# Altium schematic sheet Modulator.schdoc: Modulator v1.0
size 420 x 297 mm; Author: shanasz; CompanyName: WUT; DrawnBy: shanasz; Organization: WUT ISE; Address1: Warsaw Univeristy of Technology; Address2: Nowowiejska 15/19; DocumentNumber: 1; Revision: -; SheetNumber: 1; SheetTotal: 6; EDA_Number: ARTIQ; Projet: ARTIQ/SINARA; ModifiedBy: -; CreateDate: XX/XX/XXXX; CheckedDate: -; Title2: Top entity; DivGrp: ISE; Designer: shanasz; ModifiedDate: -; ProjectName: ARTIQ/SINARA
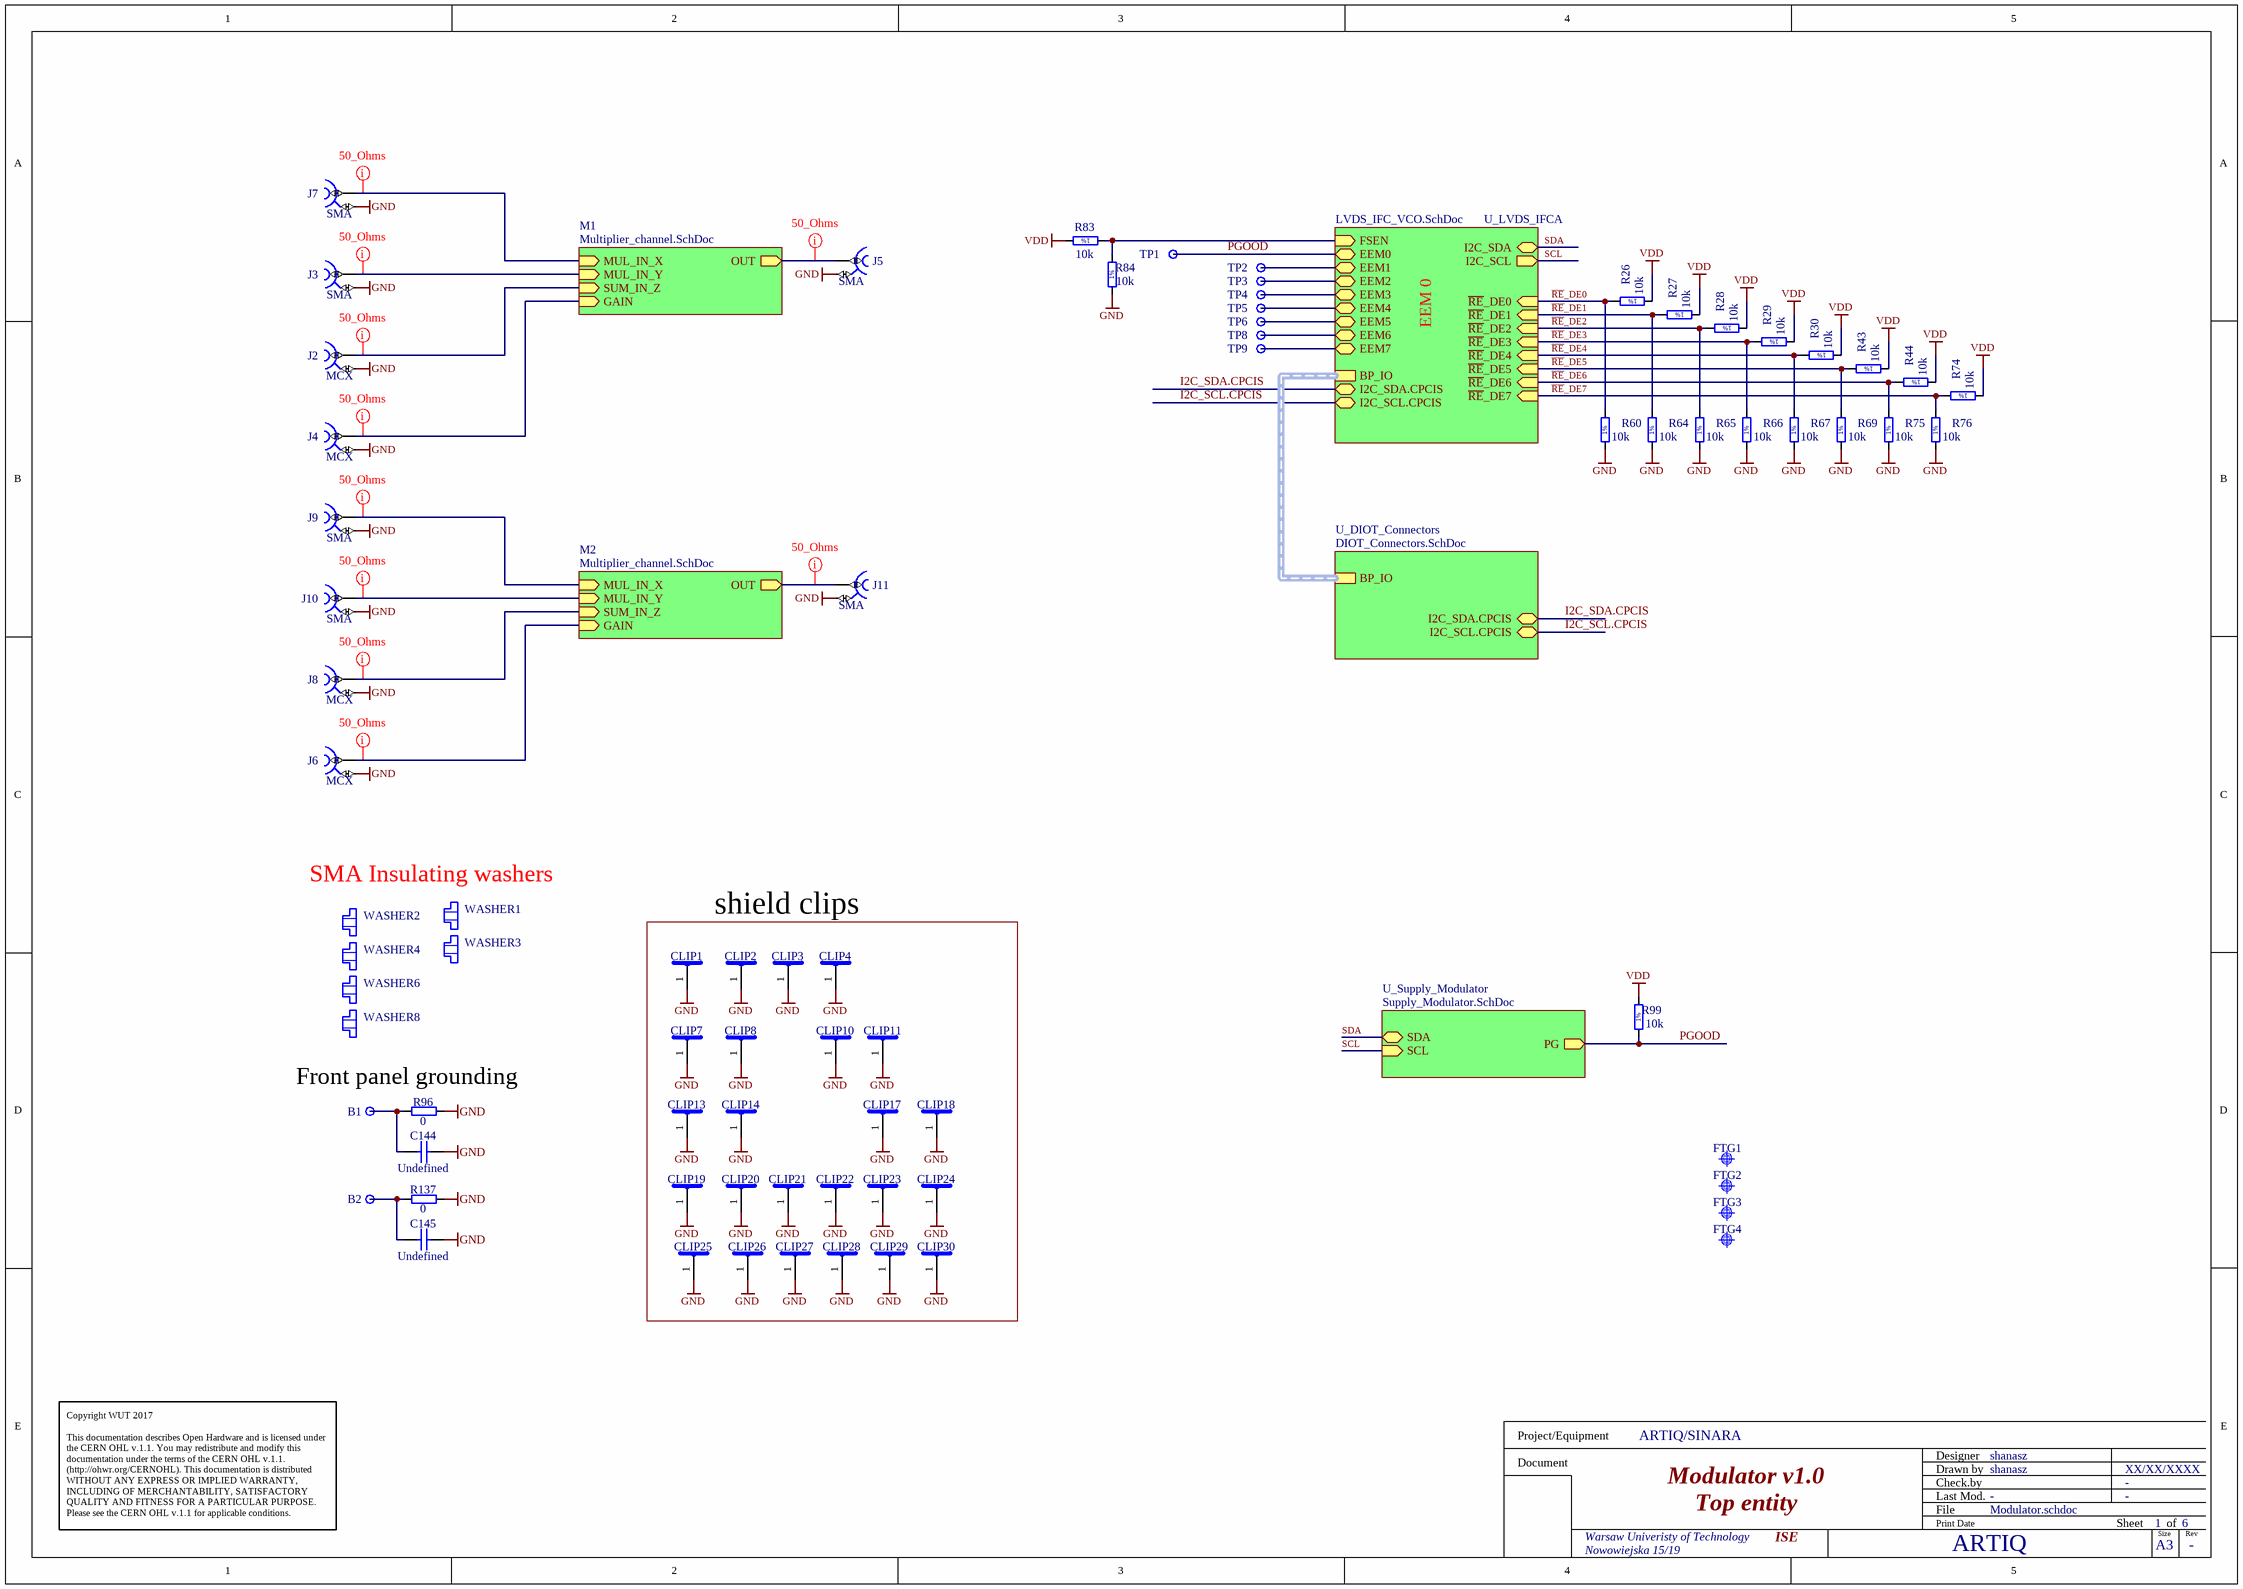
[diagram p0: Modulator.schdoc]

## Parts
B1  Plated Hole  [MTG270_500]  (value not drawn)  (no BOM)
B2  Plated Hole  [MTG270_500]  (value not drawn)  (no BOM)
C144  Undefined  [CAPC2012X135N]
C145  Undefined  [CAPC2012X135N]
CLIP1  S1411-46R  [CLIP_HOLLAND-SHIELDING_LC]  (value not drawn)
CLIP2  S1411-46R  [CLIP_HOLLAND-SHIELDING_LC]  (value not drawn)
CLIP3  S1411-46R  [CLIP_HOLLAND-SHIELDING_LC]  (value not drawn)
CLIP4  S1411-46R  [CLIP_HOLLAND-SHIELDING_LC]  (value not drawn)
CLIP7  S1411-46R  [CLIP_HOLLAND-SHIELDING_LC]  (value not drawn)
CLIP8  S1411-46R  [CLIP_HOLLAND-SHIELDING_LC]  (value not drawn)
CLIP10  S1411-46R  [CLIP_HOLLAND-SHIELDING_LC]  (value not drawn)
CLIP11  S1411-46R  [CLIP_HOLLAND-SHIELDING_LC]  (value not drawn)
CLIP13  S1411-46R  [CLIP_HOLLAND-SHIELDING_LC]  (value not drawn)
CLIP14  S1411-46R  [CLIP_HOLLAND-SHIELDING_LC]  (value not drawn)
CLIP17  S1411-46R  [CLIP_HOLLAND-SHIELDING_LC]  (value not drawn)
CLIP18  S1411-46R  [CLIP_HOLLAND-SHIELDING_LC]  (value not drawn)
CLIP19  S1411-46R  [CLIP_HOLLAND-SHIELDING_LC]  (value not drawn)
CLIP20  S1411-46R  [CLIP_HOLLAND-SHIELDING_LC]  (value not drawn)
CLIP21  S1411-46R  [CLIP_HOLLAND-SHIELDING_LC]  (value not drawn)
CLIP22  S1411-46R  [CLIP_HOLLAND-SHIELDING_LC]  (value not drawn)
CLIP23  S1411-46R  [CLIP_HOLLAND-SHIELDING_LC]  (value not drawn)
CLIP24  S1411-46R  [CLIP_HOLLAND-SHIELDING_LC]  (value not drawn)
CLIP25  S1411-46R  [CLIP_HOLLAND-SHIELDING_LC]  (value not drawn)
CLIP26  S1411-46R  [CLIP_HOLLAND-SHIELDING_LC]  (value not drawn)
CLIP27  S1411-46R  [CLIP_HOLLAND-SHIELDING_LC]  (value not drawn)
CLIP28  S1411-46R  [CLIP_HOLLAND-SHIELDING_LC]  (value not drawn)
CLIP29  S1411-46R  [CLIP_HOLLAND-SHIELDING_LC]  (value not drawn)
CLIP30  S1411-46R  [CLIP_HOLLAND-SHIELDING_LC]  (value not drawn)
FTG1  Use only in PCB  [FIDUCIAL_TOP_C100-200]  (value not drawn)  (no BOM)
FTG2  Use only in PCB  [FIDUCIAL_TOP_S100-200]  (value not drawn)  (no BOM)
FTG3  Use only in PCB  [FIDUCIAL_TOP_S200-400]  (value not drawn)  (no BOM)
FTG4  Use only in PCB  [FIDUCIAL_TOP_S100-200]  (value not drawn)  (no BOM)
J2  MCX  [AMPHENOL_919-383J-51A]
J3  SMA  [DELOCK_65848]
J4  MCX  [AMPHENOL_919-383J-51A]
J5  SMA  [DELOCK_65848]
J6  MCX  [AMPHENOL_919-383J-51A]
J7  SMA  [DELOCK_65848]
J8  MCX  [AMPHENOL_919-383J-51A]
J9  SMA  [DELOCK_65848]
J10  SMA  [DELOCK_65848]
J11  SMA  [DELOCK_65848]
R26  10k  [RESC1005X40N]
R27  10k  [RESC1005X40N]
R28  10k  [RESC1005X40N]
R29  10k  [RESC1005X40N]
R30  10k  [RESC1005X40N]
R43  10k  [RESC1005X40N]
R44  10k  [RESC1005X40N]
R60  10k  [RESC1005X40N]
R64  10k  [RESC1005X40N]
R65  10k  [RESC1005X40N]
R66  10k  [RESC1005X40N]
R67  10k  [RESC1005X40N]
R69  10k  [RESC1005X40N]
R74  10k  [RESC1005X40N]
R75  10k  [RESC1005X40N]
R76  10k  [RESC1005X40N]
R83  10k  [RESC1005X40N]
R84  10k  [RESC1005X40N]
R96  0  [RESC1608X55N]
R99  10k  [RESC1005X40N]
R137  0  [RESC1608X55N]
TP1  Test Point  [TPS127]  (value not drawn)  (no BOM)
TP2  Test Point  [TPS127]  (value not drawn)  (no BOM)
TP3  Test Point  [TPS127]  (value not drawn)  (no BOM)
TP4  Test Point  [TPS127]  (value not drawn)  (no BOM)
TP5  Test Point  [TPS127]  (value not drawn)  (no BOM)
TP6  Test Point  [TPS127]  (value not drawn)  (no BOM)
TP8  Test Point  [TPS127]  (value not drawn)  (no BOM)
TP9  Test Point  [TPS127]  (value not drawn)  (no BOM)
WASHER1  (no value)  [Keystone_7687]
WASHER2  (no value)  [Keystone_7687]
WASHER3  (no value)  [Keystone_7687]
WASHER4  (no value)  [Keystone_7687]
WASHER6  (no value)  [Keystone_7687]
WASHER8  (no value)  [Keystone_7687]

## Blocks framed on the sheet
shield clips: CLIP1-CLIP4 CLIP7 CLIP8 CLIP10 CLIP11 CLIP13 CLIP14 CLIP17-CLIP30

## Sub-sheets
M1 = Multiplier_channel.SchDoc: MUL_IN_X (in), MUL_IN_Y (in), SUM_IN_Z (in), OUT (out), GAIN (in)
M2 = Multiplier_channel.SchDoc: MUL_IN_X (in), MUL_IN_Y (in), SUM_IN_Z (in), OUT (out), GAIN (in)
U_DIOT_Connectors = DIOT_Connectors.SchDoc: BP_IO (harness BP_Conn), I2C_SDA.CPCIS (bidir), I2C_SCL.CPCIS (bidir)
U_LVDS_IFCA = LVDS_IFC_VCO.SchDoc: ~{RE}_DE1 (in), ~{RE}_DE2 (in), ~{RE}_DE3 (in), ~{RE}_DE4 (in), ~{RE}_DE5 (in), ~{RE}_DE6 (in), ~{RE}_DE7 (in), ~{RE}_DE0 (in), I2C_SDA (bidir), I2C_SCL (out), EEM1 (bidir), EEM2 (bidir), EEM5 (bidir), EEM6 (bidir), EEM7 (bidir), EEM3 (bidir), EEM4 (bidir), EEM0 (bidir), FSEN (in), BP_IO (harness BP_Conn), I2C_SDA.CPCIS (bidir), I2C_SCL.CPCIS (bidir)
U_Supply_Modulator = Supply_Modulator.SchDoc: SDA (bidir), SCL (in), PG (out)

## Nets
GND: C144.2 C145.2 CLIP1.1 CLIP2.1 CLIP3.1 CLIP4.1 CLIP7.1 CLIP8.1 CLIP10.1 CLIP11.1 CLIP13.1 CLIP14.1 CLIP17.1 CLIP18.1 CLIP19.1 CLIP20.1 CLIP21.1 CLIP22.1 CLIP23.1 CLIP24.1 CLIP25.1 CLIP26.1 CLIP27.1 CLIP28.1 CLIP29.1 CLIP30.1 J2.2 J3.2 J4.2 J5.2 J6.2 J7.2 J8.2 J9.2 J10.2 J11.2 R60.1 R64.1 R65.1 R66.1 R67.1 R69.1 R75.1 R76.1 R84.1 R96.2 R137.2
VDD: R26.1 R27.1 R28.1 R29.1 R30.1 R43.1 R44.1 R74.1 R83.1 R99.2
I2C_SCL.CPCIS: sheet U_LVDS_IFCA/I2C_SCL.CPCIS, sheet U_DIOT_Connectors/I2C_SCL.CPCIS
I2C_SDA.CPCIS: sheet U_LVDS_IFCA/I2C_SDA.CPCIS, sheet U_DIOT_Connectors/I2C_SDA.CPCIS
PGOOD: R99.1 TP1.1 ; sheet U_LVDS_IFCA/EEM0, sheet U_Supply_Modulator/PG
~{RE}_DE0: R26.2 R60.2 ; sheet U_LVDS_IFCA/~{RE}_DE0
~{RE}_DE1: R27.2 R64.2 ; sheet U_LVDS_IFCA/~{RE}_DE1
~{RE}_DE2: R28.2 R65.2 ; sheet U_LVDS_IFCA/~{RE}_DE2
~{RE}_DE3: R29.2 R66.2 ; sheet U_LVDS_IFCA/~{RE}_DE3
~{RE}_DE4: R30.2 R67.2 ; sheet U_LVDS_IFCA/~{RE}_DE4
~{RE}_DE5: R43.2 R69.2 ; sheet U_LVDS_IFCA/~{RE}_DE5
~{RE}_DE6: R44.2 R75.2 ; sheet U_LVDS_IFCA/~{RE}_DE6
~{RE}_DE7: R74.2 R76.2 ; sheet U_LVDS_IFCA/~{RE}_DE7
SCL: sheet U_LVDS_IFCA/I2C_SCL, sheet U_Supply_Modulator/SCL
SDA: sheet U_LVDS_IFCA/I2C_SDA, sheet U_Supply_Modulator/SDA
NetB1_1: B1.1 C144.1 R96.1
NetB2_1: B2.1 C145.1 R137.1
NetJ2_1: J2.1 ; sheet M1/SUM_IN_Z
NetJ3_1: J3.1 ; sheet M1/MUL_IN_Y
NetJ4_1: J4.1 ; sheet M1/GAIN
NetJ5_1: J5.1 ; sheet M1/OUT
NetJ6_1: J6.1 ; sheet M2/GAIN
NetJ7_1: J7.1 ; sheet M1/MUL_IN_X
NetJ8_1: J8.1 ; sheet M2/SUM_IN_Z
NetJ9_1: J9.1 ; sheet M2/MUL_IN_X
NetJ10_1: J10.1 ; sheet M2/MUL_IN_Y
NetJ11_1: J11.1 ; sheet M2/OUT
NetR83_2: R83.2 R84.2 ; sheet U_LVDS_IFCA/FSEN
NetTP2_1: TP2.1 ; sheet U_LVDS_IFCA/EEM1
NetTP3_1: TP3.1 ; sheet U_LVDS_IFCA/EEM2
NetTP4_1: TP4.1 ; sheet U_LVDS_IFCA/EEM3
NetTP5_1: TP5.1 ; sheet U_LVDS_IFCA/EEM4
NetTP6_1: TP6.1 ; sheet U_LVDS_IFCA/EEM5
NetTP8_1: TP8.1 ; sheet U_LVDS_IFCA/EEM6
NetTP9_1: TP9.1 ; sheet U_LVDS_IFCA/EEM7

## Buses and harness runs
harness sheet U_DIOT_Connectors/BP_IO = sheet U_LVDS_IFCA/BP_IO

## Layout directives
net class 50_Ohms: NetJ2_1, NetJ3_1, NetJ4_1, NetJ5_1, NetJ6_1, NetJ7_1, NetJ8_1, NetJ9_1, NetJ10_1, NetJ11_1

## Notes on the sheet
- EEM 0
- SMA Insulating washers
- Front panel grounding
- Copyright WUT 2017
  This documentation describes Open Hardware and is licensed under the CERN OHL v.1.1. You may redistribute and modify this documentation under the terms of the CERN OHL v.1.1. (http://ohwr.org/CERNOHL). This documentation is distributed WITHOUT ANY EXPRESS OR IMPLIED WARRANTY, INCLUDING OF MERCHANTABILITY, SATISFACTORY QUALITY AND FITNESS FOR A PARTICULAR PURPOSE. Please see the CERN OHL v.1.1 for applicable conditions.
- Project/Equipment
- Document
- Designer
- Drawn by
- Check.by
- File
- Last Mod.
- Print Date
- Sheet
- Size
- A3
- of
- Rev
- (in symbol R0402_10K_1%_0.0625W_100PPM) 1%

## Library data of the parts
B1 B2 = PLATED_HOLE2.7_PAD5.0: Single Terminal Socket; Part Description: Plated Through Hole: Hole Dia.=2.7mm Pad Dia.=5.0mm; Mounted: No; Part Number: PLATED_HOLE2.7_PAD5.0; Component Type: Standard (No BOM); Pin Count: 1; Family: Plated Hole; Socket: No; SMD: No; Sense: No; Status: None; ComponentHeight: 0mm; HelpURL: Undefined; Author: CERN DEM JMW; CreateDate: 27.09.2011; LatestRevisionDate: 27.09.2011; PackageDescription: Plated Through Hole: Hole Dia.=2.7mm Pad Dia.=5.0mm
C144 C145 = CC0805_NO-VALUE: Non-polarised capacitor; Part Description: Reserved Footprint For 0805(2012) Chip Ceramic Capacitor; Mounted: No; Part Number: CC0805_NO-VALUE; Component Kind: Standard; Component Type: Standard; Pin Count: 2; Value: Undefined; Status: None; Manufacturer: Undefined; Manufacturer Part Number: CC0805_NO-VALUE; Case: 0805; Socket: No; SMD: Yes; Sense: No; Manufacturer1 ComponentHeight: 1.35mm; HelpURL: Undefined; Author: CERN DEM JLC; CreateDate: 10.12.2008; LatestRevisionDate: 11.09.2013
CLIP1-CLIP4 CLIP7 CLIP8 CLIP10 CLIP11 CLIP13 CLIP14 CLIP17-CLIP30 = SHIELD_CLIP: Surface Mount Clip for PCB Screening Covers; Part Description: Surface Mount Clip for PCB Screening Covers, 1500 Serie; Manufacturer: HARWIN; PressFit: No; Table: Metal Screening Box; Part Number: S1411-46R; Component Kind: Standard; Component Type: Standard; Pin Count: 1; PackageDescription: Surface Mount Clip for PCB Screening Covers, 1500 Serie; Mounted: Yes; Socket: No; SMD: Yes; Status: None; Manufacturer Part Number: S1411-46R; ComponentHeight: 3.5mm; HelpURL: \\cern.ch\dfs\Applications\Altium\Datasheets\CLIP_HOLLAND-SHIELDING_LC.pdf; Author: CERN DEM JLC; CreateDate: 2013-06-25; LatestRevisionDate: 2013-06-25
FTG1 = FIDUCIAL_TARGET_C100-200: Fiducial Target; Part Description: Round Fiducial Target, Top Layer, 1.0mm, Top Solder 2.0mm, Keepout =2.0mm; Mounted: No; Part Number: FIDUCIAL_TARGET_C100-200; Component Type: Standard (No BOM); Pin Count: 1; Family: Fiducial; Socket: No; SMD: Yes; Sense: No; Status: None; ComponentHeight: 0mm; HelpURL: Undefined; Author: CERN DEM JLC; CreateDate: 09.02.2010; LatestRevisionDate: 04.04.2012; PackageDescription: Round Fiducial Target, Top Layer, 1.0mm, Top Solder 2.0mm, Keepout =2.0mm
FTG2 FTG4 = FIDUCIAL_TARGET_S100-200: Fiducial Target; Part Description: Square Fiducial Target, Top Layer, 1.0mm, Top Solder 2.0mm, Keepout =2.0mm; Mounted: No; Part Number: FIDUCIAL_TARGET_S100-200; Component Type: Standard (No BOM); Pin Count: 1; Family: Fiducial; Socket: No; SMD: Yes; Sense: No; Status: None; ComponentHeight: 0mm; HelpURL: Undefined; Author: CERN DEM JLC; CreateDate: 09.02.2010; LatestRevisionDate: 04.04.2012; PackageDescription: Square Fiducial Target, Top Layer, 1.0mm, Top Solder 2.0mm, Keepout =2.0mm
FTG3 = FIDUCIAL_TARGET_S200-400: Fiducial Target; Part Description: Square Fiducial Target, Top Layer, 2.0mm, Top Solder 4.0mm, Keepout =4.0mm; Mounted: No; Part Number: FIDUCIAL_TARGET_S200-400; Component Type: Standard (No BOM); Pin Count: 1; Family: Fiducial; Socket: No; SMD: Yes; Sense: No; Status: None; ComponentHeight: 0mm; HelpURL: Undefined; Author: CERN DEM JLC; CreateDate: 02.06.2008; LatestRevisionDate: 04.04.2012; PackageDescription: Square Fiducial Target, Top Layer, 2.0mm, Top Solder 4.0mm, Keepout =4.0mm
J2 J4 J6 J8 = AMPHENOL_919-383J-51A: Part Description: 50 Ohm, RF Connector, MCX Right Angle PCB Receptacle Jack; PressFit: No; Part Number: AMPHENOL_919-383J-51A; Component Kind: Standard; Component Type: Standard; Pin Count: 5; Family: MCX; Mounted: Yes; Socket: No; SMD: No; Sense: No; Status: None; Manufacturer: AMPHENOL; Manufacturer Part Number: 919-383J-51A; ComponentHeight: 6mm; HelpURL: \\cern.ch\dfs\Applications\Altium\Datasheets\AMPHENOL_919-383J-51A.pdf; Author: CERN DEM BC; CreateDate: 31.01.2019; LatestRevisionDate: 31.01.2019
J3 J5 J7 J9-J11 = CON_SMA_DELOCK_65848: 50 Ohm Through Hole SMA Right Angle PCB Jack; Manufacturer: DELOCK; Manufacturer Part Number: 5848 (4043619658480); PressFit: No; Part Number: DELOCK_65848; Component Kind: Standard; Component Type: Standard; Pin Count: 5; Family: SMA; Mounted: Yes; Socket: No; SMD: No; Sense: No; Status: None; Part Description: 50 Ohm Through Hole SMA Right Angle PCB Jack; ComponentHeight: 12.5; HelpURL: \\cern.ch\dfs\Applications\Altium\Datasheets\AMPHENOL_132203-16.pdf; Author: GK; CreateDate: 13.05.2019; LatestRevisionDate: 13.05.2019
R26-R30 R43 R44 R60 R64-R67 R69 R74-R76 R83 R84 R99 = R0402_10K_1%_0.0625W_100PPM: Resistor - 1%; Part Description: General Purpose Thick Film Chip Resistor; Manufacturer: GENERIC; Manufacturer1 Part Number: 232270671003L; TC: ±100ppm/°C; PressFit: No; Part Number: R0402_10K_1%_0.0625W_100PPM; Component Kind: Standard; Component Type: Standard; Pin Count: 2; Value: 10k; Status: Not Recommended; Power: 0.0625W; Tolerance: ±1%; Manufacturer Part Number: R0402_10K_1%_0.0625W_100PPM; Case: 0402; Mounted: Yes; Sense: No; Socket: No; SMD: Yes; Manufacturer1 Example: YAGEO PHYCOMP; Manufacturer1 ComponentHeight: 0.4mm; HelpURL: \\cern.ch\dfs\Applications\Altium\Datasheets\R0402_Phycomp_RC0402.pdf; Author: CERN DEM JLC; CreateDate: 03.12.2007; LatestRevisionDate: 17.10.2012
R96 R137 = R0603_0R_JUMPER: Resistor; Part Description: 1A (0.05R Max DC Resistance) Zero Ohm Jumper; Manufacturer: GENERIC; Manufacturer1 Part Number: NRC06Z0; PressFit: No; Part Number: R0603_0R_JUMPER; Component Kind: Standard; Component Type: Standard; Pin Count: 2; Value: 0; Status: Preferred; Manufacturer Part Number: R0603_0R_JUMPER; Case: 0603; Mounted: Yes; Sense: No; Socket: No; SMD: Yes; Manufacturer1 Example: NIC COMPONENT; Manufacturer1 ComponentHeight: 0.55mm; HelpURL: \\cern.ch\dfs\Applications\Altium\Datasheets\R0603_NIC_NRC.pdf; Author: CERN DEM JLC; CreateDate: 03.12.2007; LatestRevisionDate: 13.03.2008
TP1-TP6 TP8 TP9 = SMD_PAD_1.27X1.27MM: Part Description: 1.27mm x 1.27mm PCB Copper Area (SMD Test Point); Mounted: No; Part Number: SMD_PAD_1.27X1.27MM; Component Type: Standard (No BOM); Pin Count: 1; Family: Test Point; Socket: No; SMD: Yes; Sense: No; Status: None; ComponentHeight: 0mm; HelpURL: Undefined; Author: CERN DEM JLC; CreateDate: 12.01.2008; LatestRevisionDate: 12.01.2008; PackageDescription: 1.27mm x 1.27mm PCB Copper Area (SMD Test Point)
WASHER1-WASHER4 WASHER6 WASHER8 = Keystone_7687: SMA_Shoulder Washer; Part Number: custom 3D printed; Part Description: Polyphenylene Sulfide PPS Shoulder Washer; Manufacturer: custom; PressFit: No; Value: custom 3D printed; Component Kind: Standard; Component Type: Mechanical; Footprint: custom 3D printed; Pin Count: 0; PackageDescription: custom 3D printed; Mounted: Yes; Socket: No; SMD: No; Sense: No; Status: None; Manufacturer Part Number: custom 3D printed; ComponentHeight: 1.91mm; HelpURL: \\cern.ch\dfs\Applications\Altium\Datasheets\AAVID-THERMALLOY_7721-7PPSG.pdf; Author: GK; CreateDate: 28.01.2016; LatestRevisionDate: 28.01.2016